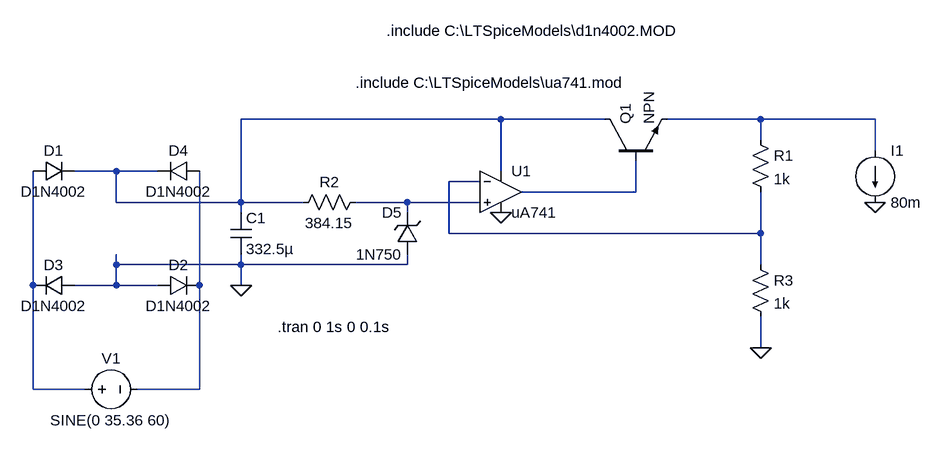
[diagram p0: schematic 4-5-full.asc]
4-5-full.asc, the LTspice schematic file:
Version 4
SHEET 1 1680 680
WIRE 800 0 400 0
WIRE 960 0 800 0
WIRE 1200 0 1056 0
WIRE 1376 0 1200 0
WIRE 1200 32 1200 0
WIRE 1376 48 1376 0
WIRE 208 80 144 80
WIRE 272 80 208 80
WIRE 800 80 800 0
WIRE 768 96 720 96
WIRE 1008 112 1008 64
WIRE 1008 112 832 112
WIRE 208 128 208 80
WIRE 400 128 400 0
WIRE 400 128 208 128
WIRE 496 128 400 128
WIRE 656 128 576 128
WIRE 768 128 656 128
WIRE 400 144 400 128
WIRE 656 144 656 128
WIRE 720 176 720 96
WIRE 1200 176 1200 112
WIRE 1200 176 720 176
WIRE 208 224 208 208
WIRE 400 224 400 208
WIRE 400 224 208 224
WIRE 656 224 656 208
WIRE 656 224 400 224
WIRE 1200 224 1200 176
WIRE 80 256 80 80
WIRE 208 256 208 224
WIRE 208 256 144 256
WIRE 272 256 208 256
WIRE 336 256 336 80
WIRE 400 256 400 224
WIRE 1200 352 1200 304
WIRE 80 416 80 256
WIRE 160 416 80 416
WIRE 336 416 336 256
WIRE 336 416 240 416
FLAG 400 256 0
FLAG 800 144 0
FLAG 1200 352 0
FLAG 1376 128 0
SYMBOL voltage 144 416 R270
WINDOW 0 32 56 VTop 2
WINDOW 3 -32 56 VBottom 2
WINDOW 123 0 0 Left 0
WINDOW 39 0 0 Left 0
SYMATTR InstName V1
SYMATTR Value SINE(0 35.36 60)
SYMBOL diode 80 96 R270
WINDOW 0 32 32 VTop 2
WINDOW 3 0 32 VBottom 2
SYMATTR InstName D1
SYMATTR Value D1N4002
SYMBOL diode 272 272 R270
WINDOW 0 32 32 VTop 2
WINDOW 3 0 32 VBottom 2
SYMATTR InstName D2
SYMATTR Value D1N4002
SYMBOL diode 144 240 R90
WINDOW 0 0 32 VBottom 2
WINDOW 3 32 32 VTop 2
SYMATTR InstName D3
SYMATTR Value D1N4002
SYMBOL diode 336 64 R90
WINDOW 0 0 32 VBottom 2
WINDOW 3 32 32 VTop 2
SYMATTR InstName D4
SYMATTR Value D1N4002
SYMBOL cap 384 144 R0
SYMATTR InstName C1
SYMATTR Value 332.5µ
SYMBOL res 592 112 R90
WINDOW 0 0 56 VBottom 2
WINDOW 3 32 56 VTop 2
SYMATTR InstName R2
SYMATTR Value 384.15
SYMBOL zener 672 208 R180
WINDOW 0 24 64 Left 2
WINDOW 3 24 0 Left 2
SYMATTR InstName D5
SYMATTR Value 1N750
SYMBOL OpAmps\\opamp2 800 48 R0
SYMATTR InstName U1
SYMATTR Value uA741
SYMBOL res 1184 16 R0
SYMATTR InstName R1
SYMATTR Value 1k
SYMBOL res 1184 208 R0
SYMATTR InstName R3
SYMATTR Value 1k
SYMBOL current 1376 48 R0
WINDOW 123 0 0 Left 0
WINDOW 39 0 0 Left 0
SYMATTR InstName I1
SYMATTR Value 80m
SYMBOL npn 960 64 R270
SYMATTR InstName Q1
TEXT 456 320 Left 2 !.tran 0 1s 0 0.1s
TEXT 576 -56 Left 2 !.include C:\\LTSpiceModels\\ua741.mod
TEXT 624 -136 Left 2 !.include C:\\LTSpiceModels\\d1n4002.MOD

The netlist it stands for:
* 4-5-full.asc
V1 N006 N007 SINE(0 35.36 60)
D1 N006 N001 D1N4002
D2 0 N007 D1N4002
D3 0 N006 D1N4002
D4 N007 N001 D1N4002
C1 N001 0 332.5µ
R2 N005 N001 384.15
D5 0 N005 1N750
XU1 N005 N003 N001 0 N004 uA741  ; pins In+ In- V+ V- OUT
R1 N002 N003 1k
R3 N003 0 1k
I1 N002 0 80m
Q1 N001 N004 N002 0 NPN
.model D D
.lib standard.dio
.model NPN NPN
.model PNP PNP
.lib standard.bjt
.tran 0 1s 0 0.1s
.include C:\LTSpiceModels\ua741.mod
.include C:\LTSpiceModels\d1n4002.MOD
.backanno
.end